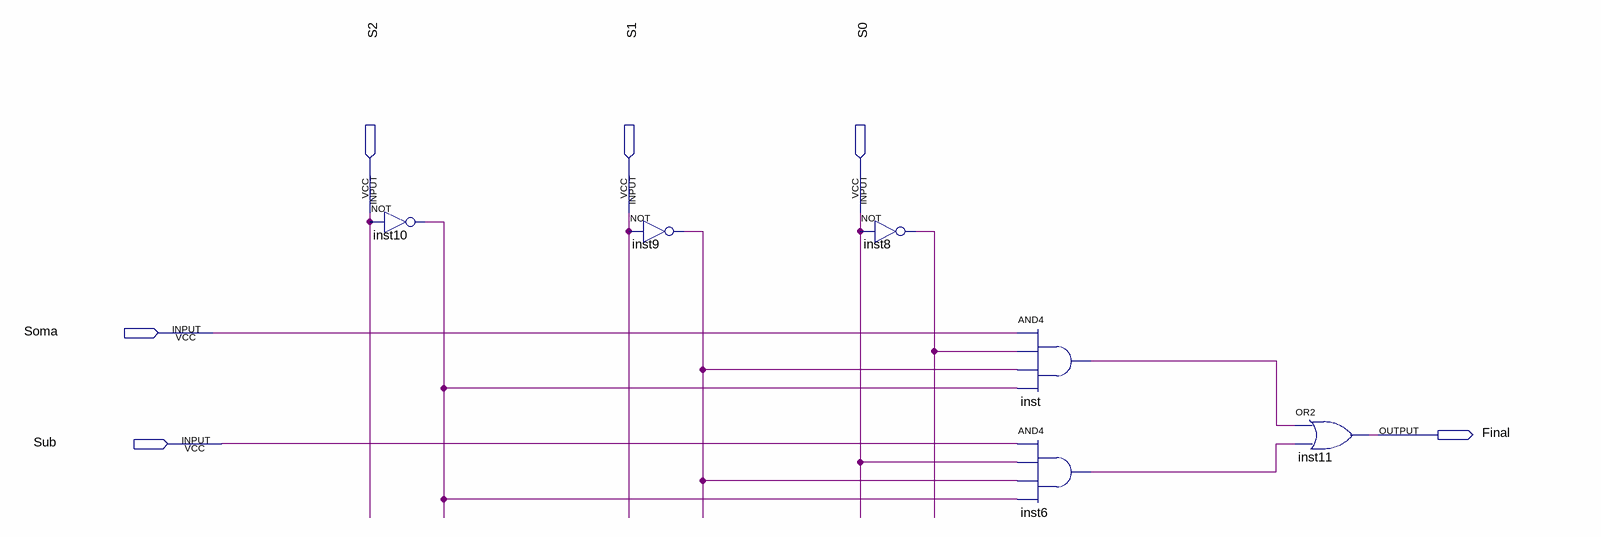
[diagram p0: schematic sheet]
// Quartus schematic Selec_Display.bdf as structural Verilog: 6 symbols, 6 pins
module Selec_Display (
  input  S2,
  input  S1,
  input  S0,
  input  Soma,
  input  Sub,
  output Final
);

  wire inst6_out, inst8_out, inst9_out, inst10_out, inst_out;

  not inst10 (inst10_out, S2);
  not inst9 (inst9_out, S1);
  not inst8 (inst8_out, S0);
  and inst (inst_out, Soma, inst8_out, inst9_out, inst10_out);
  and inst6 (inst6_out, Sub, S0, inst9_out, inst10_out);
  or inst11 (Final, inst_out, inst6_out);
endmodule
